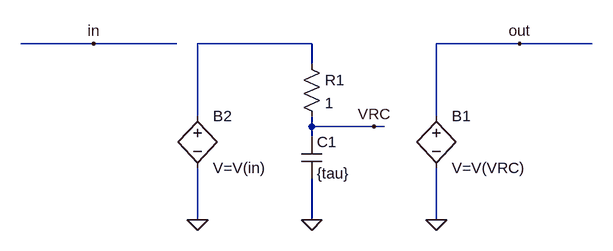
[diagram p0: schematic ideal_pole.asc]
ideal_pole.asc, the LTspice schematic file:
Version 4
SHEET 1 2652 680
WIRE 528 32 416 32
WIRE 656 32 528 32
WIRE 864 32 688 32
WIRE 1184 32 1056 32
WIRE 1296 32 1184 32
WIRE 864 64 864 32
WIRE 688 144 688 32
WIRE 1056 144 1056 32
WIRE 864 160 864 144
WIRE 960 160 864 160
WIRE 976 160 960 160
WIRE 864 176 864 160
WIRE 688 304 688 224
WIRE 864 304 864 240
WIRE 1056 304 1056 224
FLAG 688 304 0
FLAG 528 32 in
FLAG 1056 304 0
FLAG 1184 32 out
FLAG 864 304 0
FLAG 960 160 VRC
SYMBOL bv 688 128 R0
SYMATTR InstName B2
SYMATTR Value V=V(in)
SYMBOL bv 1056 128 R0
SYMATTR InstName B1
SYMATTR Value V=V(VRC)
SYMBOL res 848 48 R0
SYMATTR InstName R1
SYMATTR Value 1
SYMBOL cap 848 176 R0
SYMATTR InstName C1
SYMATTR Value {tau}

The netlist it stands for:
* ideal_pole.asc
B2 N001 0 V=V(in)
B1 out 0 V=V(VRC)
R1 N001 VRC 1
C1 VRC 0 {tau}
.backanno
.end